# EAGLE design satellite (EAGLE 7.2.0)
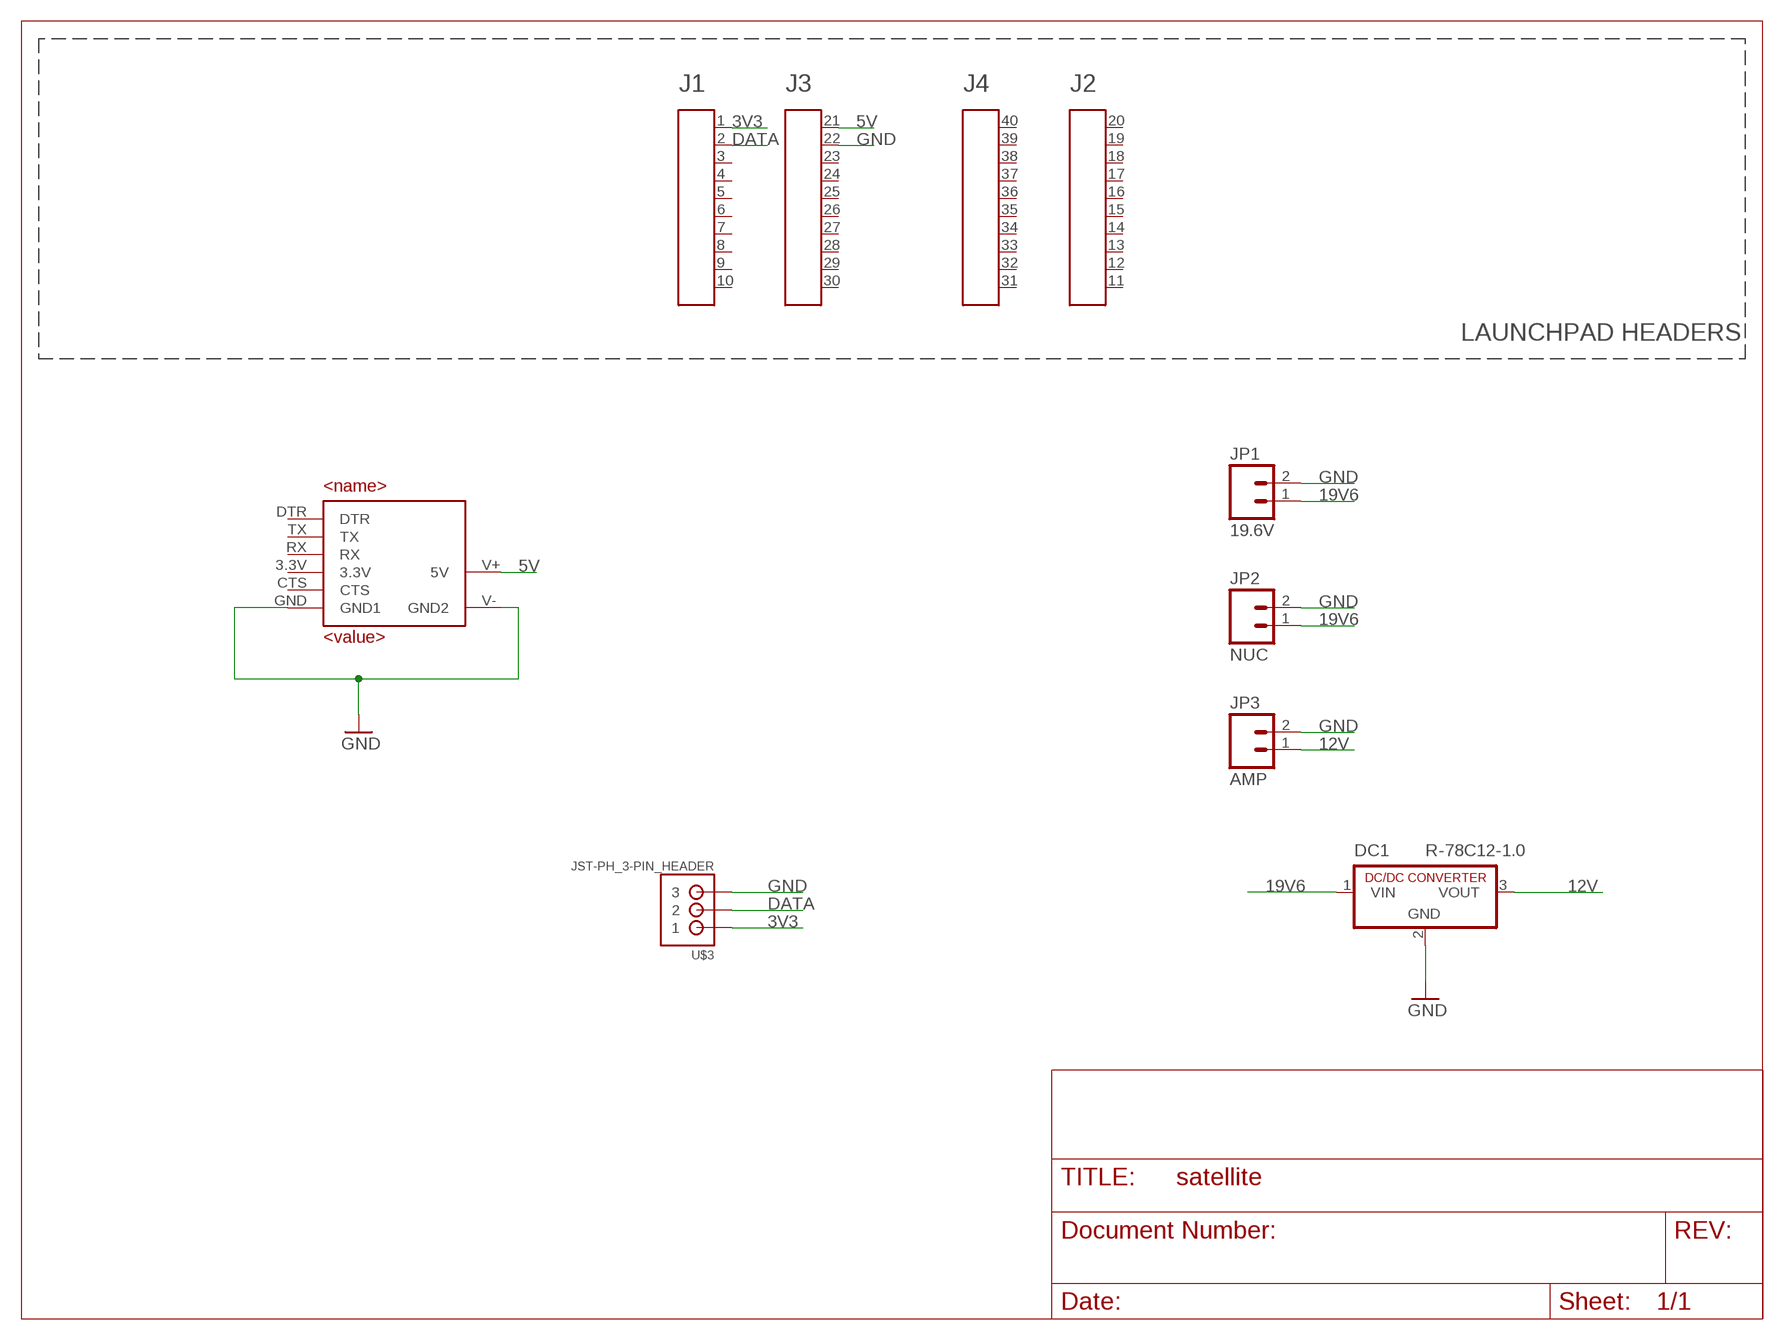
[diagram p0: schematic, sheet 1]

## Parts
A1  HEADER4X10-BOOSTERPACK  [4X10-BOOSTERPACK]
DC1  R-78C12-1.0  [SIP3]
JP1  19.6V  M023.5MM  [SCREWTERMINAL-3.5MM-2]
JP2  NUC  M023.5MM  [SCREWTERMINAL-3.5MM-2]
JP3  AMP  M023.5MM  [SCREWTERMINAL-3.5MM-2]
U1  9DOF  [9DOF]
U$3  JST-PH_3-PIN_HEADER  [JST_B3B-PH_HEADER]

## Nets
3V3: A1.1 U$3.P1
5V: A1.21 U1.V+(5V)
12V: DC1.3(VOUT) JP3.1
19V6: DC1.1(VIN) JP1.1 JP2.1
DATA: A1.2 U$3.P2
GND: A1.22 DC1.2(GND) JP1.2 JP2.2 JP3.2 U1.GND(GND1) U1.V-(GND2) U$3.P3
Unconnected: A1.3 A1.4 A1.5 A1.6 A1.7 A1.8 A1.9 A1.10 A1.11 A1.12 A1.13 A1.14 A1.15 A1.16 A1.17 A1.18 A1.19 A1.20 A1.23 A1.24 A1.25 A1.26 A1.27 A1.28 A1.29 A1.30 A1.31 A1.32 A1.33 A1.34 A1.35 A1.36 A1.37 A1.38 A1.39 A1.40 U1.3.3V U1.CTS U1.DTR U1.RX U1.TX

## Notes on the sheet
- LAUNCHPAD HEADERS

## Library data of the parts
A1 = Public_BP_Library:HEADER4X10-BOOSTERPACK
DC1 = dc-dc-converter:R-78C*-1.0: INNOLINE DC/DC-Converter 1.0 AMP SIP3 Single Output Source: Data sheet <http://www.mikrocontroller.net/attachment/150645/157764-da-01-en-DC_DC_WANDLER_R_78C5_0_1_0.pdf>
JP1-JP3 = SparkFun-Connectors:M02: Standard 2-pin 0.1" header. Use with - straight break away headers ( PRT-00116) - right angle break away headers (PRT-00553) - swiss pins (PRT-00743) - machine pins (PRT-00117) - female headers (PRT-00115) Molex polarized connector foot print use with: PRT-08233 with associated crimp pins and housings. 2.54_SCREWTERM for use with PRT-10571. 3.5mm Screw Terminal footprints for PRT-08084 5mm Screw Terminal footprints for use with PRT-08432; PROD_ID: CONN-08399
U1 = satellite:9DOF
U$3 = SRG:JST-PH_3-PIN_HEADER: 3-pin JST PH Shrouded Header, top entry P/N B3B-PH-K-S Mating connector PHR-3

## Board
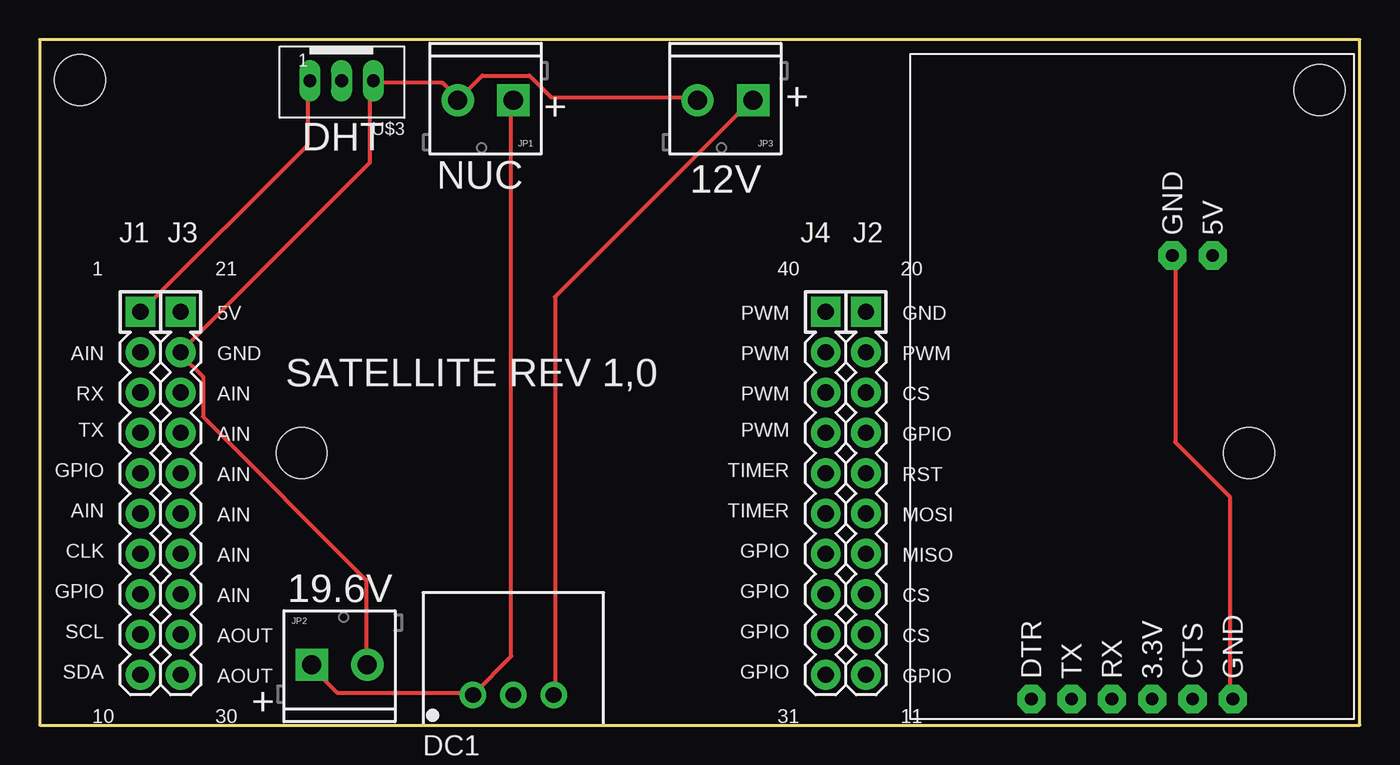
[diagram p1: board, top side]
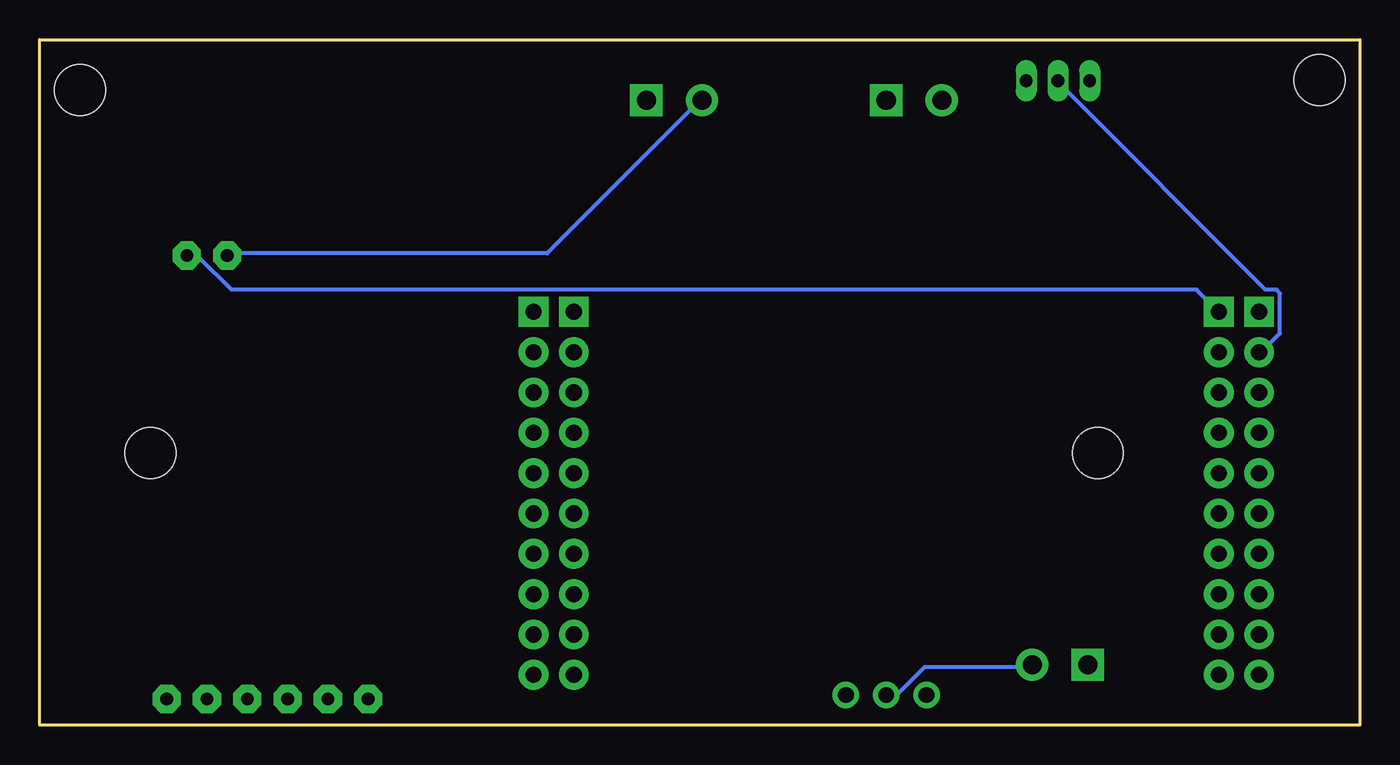
[diagram p2: board, bottom side, seen from below]

Size 83.19 x 43.18 mm. Coordinates in mm from the lower left corner, seen from the top.
Outline: 0,0 83.19,0 83.19,43.18 0,43.18 0,0
Copper layers (1*16): Top 0.035mm / dielectric 1.5mm / Bottom 0.035mm
Design rules "default": minimum track width 10mil, minimum drill 24mil, track to track 8mil, track to pad 8mil, pad to pad 8mil, via to via 8mil, smd to smd 8mil, copper to edge 40mil, drill to drill 8mil, minimum pad ring 10mil, minimum via ring 8mil, stop-mask expansion 4mil, vias tented up to drill 0mil, thermal gap 10mil
Holes 3.2 mm at 16.51,17.14 2.54,40.64 76.2,17.14 80.64,40.01

### Footprints (pad centres in the part's own frame; a part is rotated, then mirrored left to right if it is on the bottom)
4X10-BOOSTERPACK = drill 1.016 pad 1.88 square: 1 0,10.16; 20 45.72,10.16; 21 2.54,10.16; 40 43.18,10.16 | drill 1.016 pad 1.88: 2 0,7.62; 3 0,5.08; 4 0,2.54; 5 0,0; 6 0,-2.54; 7 0,-5.08; 8 0,-7.62; 9 0,-10.16; 10 0,-12.7; 11 45.72,-12.7; 12 45.72,-10.16; 13 45.72,-7.62; 14 45.72,-5.08; 15 45.72,-2.54; 16 45.72,0; 17 45.72,2.54; 18 45.72,5.08; 19 45.72,7.62; 22 2.54,7.62; 23 2.54,5.08; 24 2.54,2.54; 25 2.54,0; 26 2.54,-2.54; 27 2.54,-5.08; 28 2.54,-7.62; 29 2.54,-10.16; 30 2.54,-12.7; 31 43.18,-12.7; 32 43.18,-10.16; 33 43.18,-7.62; 34 43.18,-5.08; 35 43.18,-2.54; 36 43.18,0; 37 43.18,2.54; 38 43.18,5.08; 39 43.18,7.62
SIP3 = drill 1 pad 1.676: 1 -2.54,0; 2 0,0; 3 2.54,0
SCREWTERMINAL-3.5MM-2 = drill 1.2 pad 2.032 square: 1 0,0 | drill 1.2 pad 2.032: 2 3.5,0
9DOF = drill 0.8 pad 1.778 octagon: 3.3V 1.27,12.7; CTS 1.27,10.16; DTR 1.27,20.32; GND 1.27,7.62; RX 1.27,15.24; TX 1.27,17.78; V+ 29.21,8.89; V- 29.21,11.43
JST_B3B-PH_HEADER = drill 0.8 long: P1 2.027,0.048; P2 0.028,0.048; P3 -1.972,0.048

### Placement (x,y rotation side)
A1  6.35,15.88 0 top
DC1  29.84,1.91 0 top
JP1  29.84,39.37 180 top
JP2  17.14,3.81 0 top
JP3  44.96,39.37 180 top
U1  82.8,0.38 90 top
U$3  19.05,40.64 180 top

### Tracks (layer width: path | path; a pad name or v marks a point on that pad's centre or on a via)
3V3
  Top 0.254: U$3.P1 16.92,40.46 16.92,36.58 6.4,26.06 A1.1
5V
  Bottom 0.254: A1.21 10.29,27.43 71.09,27.43 73.15,29.49 73.84,29.49 U1.V+
12V
  Top 0.254: DC1.3 32.46,2.06 32.46,26.98 44.81,39.32 JP3.1
19V6
  Top 0.254: JP2.1 17.14,3.66 18.75,2.06 27.2,2.06 DC1.1 27.43,2.06 29.72,4.34 29.72,39.32 JP1.1
DATA
  Bottom 0.254: U$3.P2 18.97,40.46 5.94,27.43 5.26,27.43 5.03,27.2 5.03,24.69 6.17,23.55 A1.2
GND
  Top 0.254: U1.GND 74.98,1.83 74.98,14.4 71.55,17.83 71.55,29.49 U1.V- | JP3.2 41.38,39.55 32.23,39.55 30.86,40.92 27.89,40.92 26.52,39.55 JP1.2 26.29,39.55 25.38,40.46 21.03,40.46 U$3.P3 20.8,40.46 20.8,35.43 8.91,23.55 A1.22 8.91,23.32 10.29,21.95 10.29,19.43 20.57,9.14 20.57,3.89 JP2.2
  Bottom 0.254: DC1.2 29.72,2.06 29.03,2.06 27.43,3.66 20.8,3.66 JP2.2 | U1.V- 71.32,29.72 51.21,29.72 41.6,39.32 JP3.2

### Text on the board
tPlace: + | + | DHT | NUC | 12V | SATELLITE REV 1,0 | 19.6V | +